# EAGLE schematic Hive 1.1 (EAGLE 9.6.2)
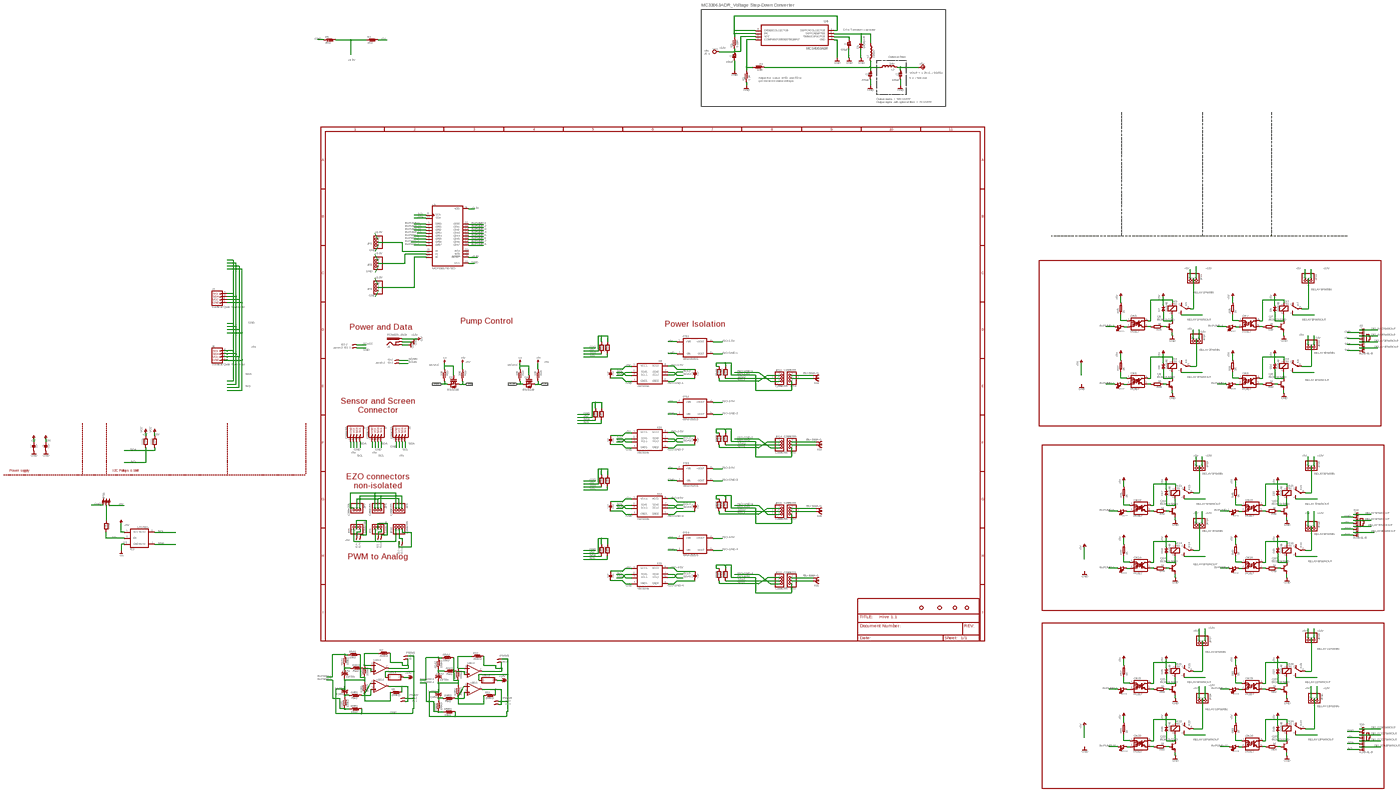
[diagram p0: schematic, sheet 1, overview]
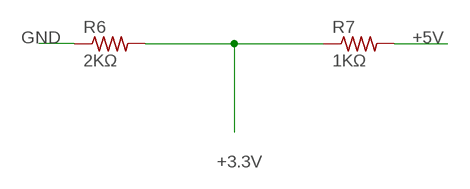
[diagram p1: schematic, sheet 1, part 1 of 5]
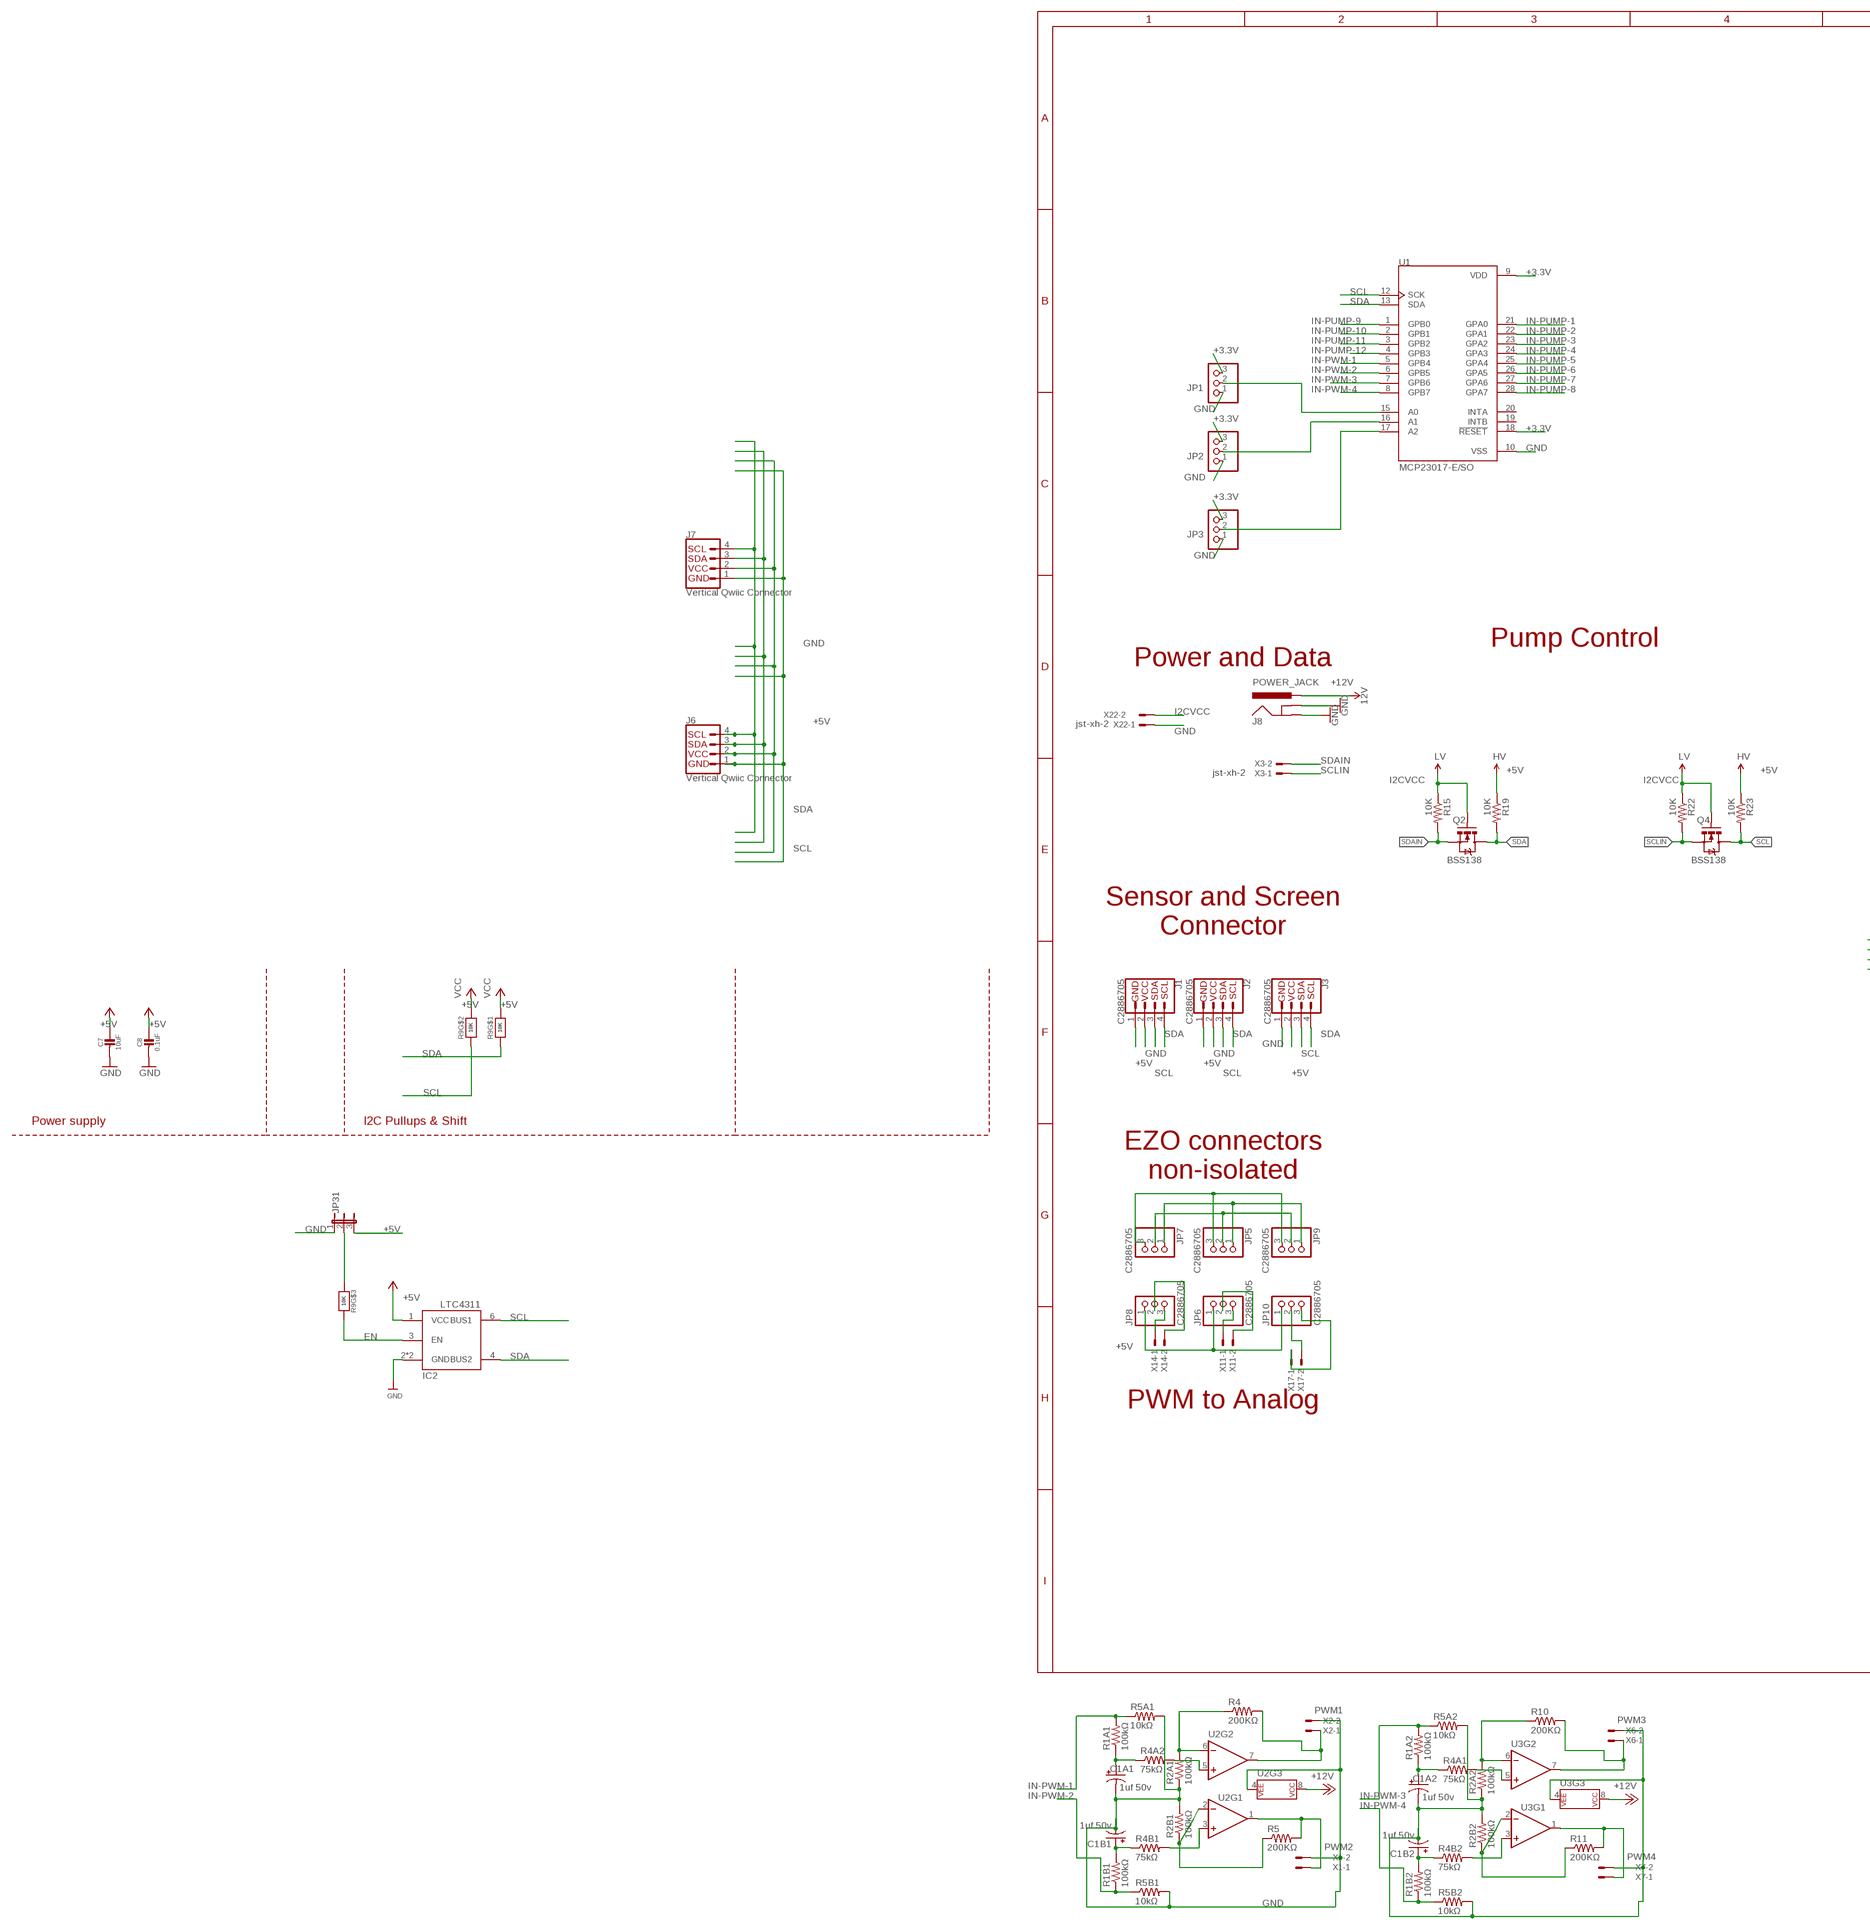
[diagram p2: schematic, sheet 1, part 2 of 5]
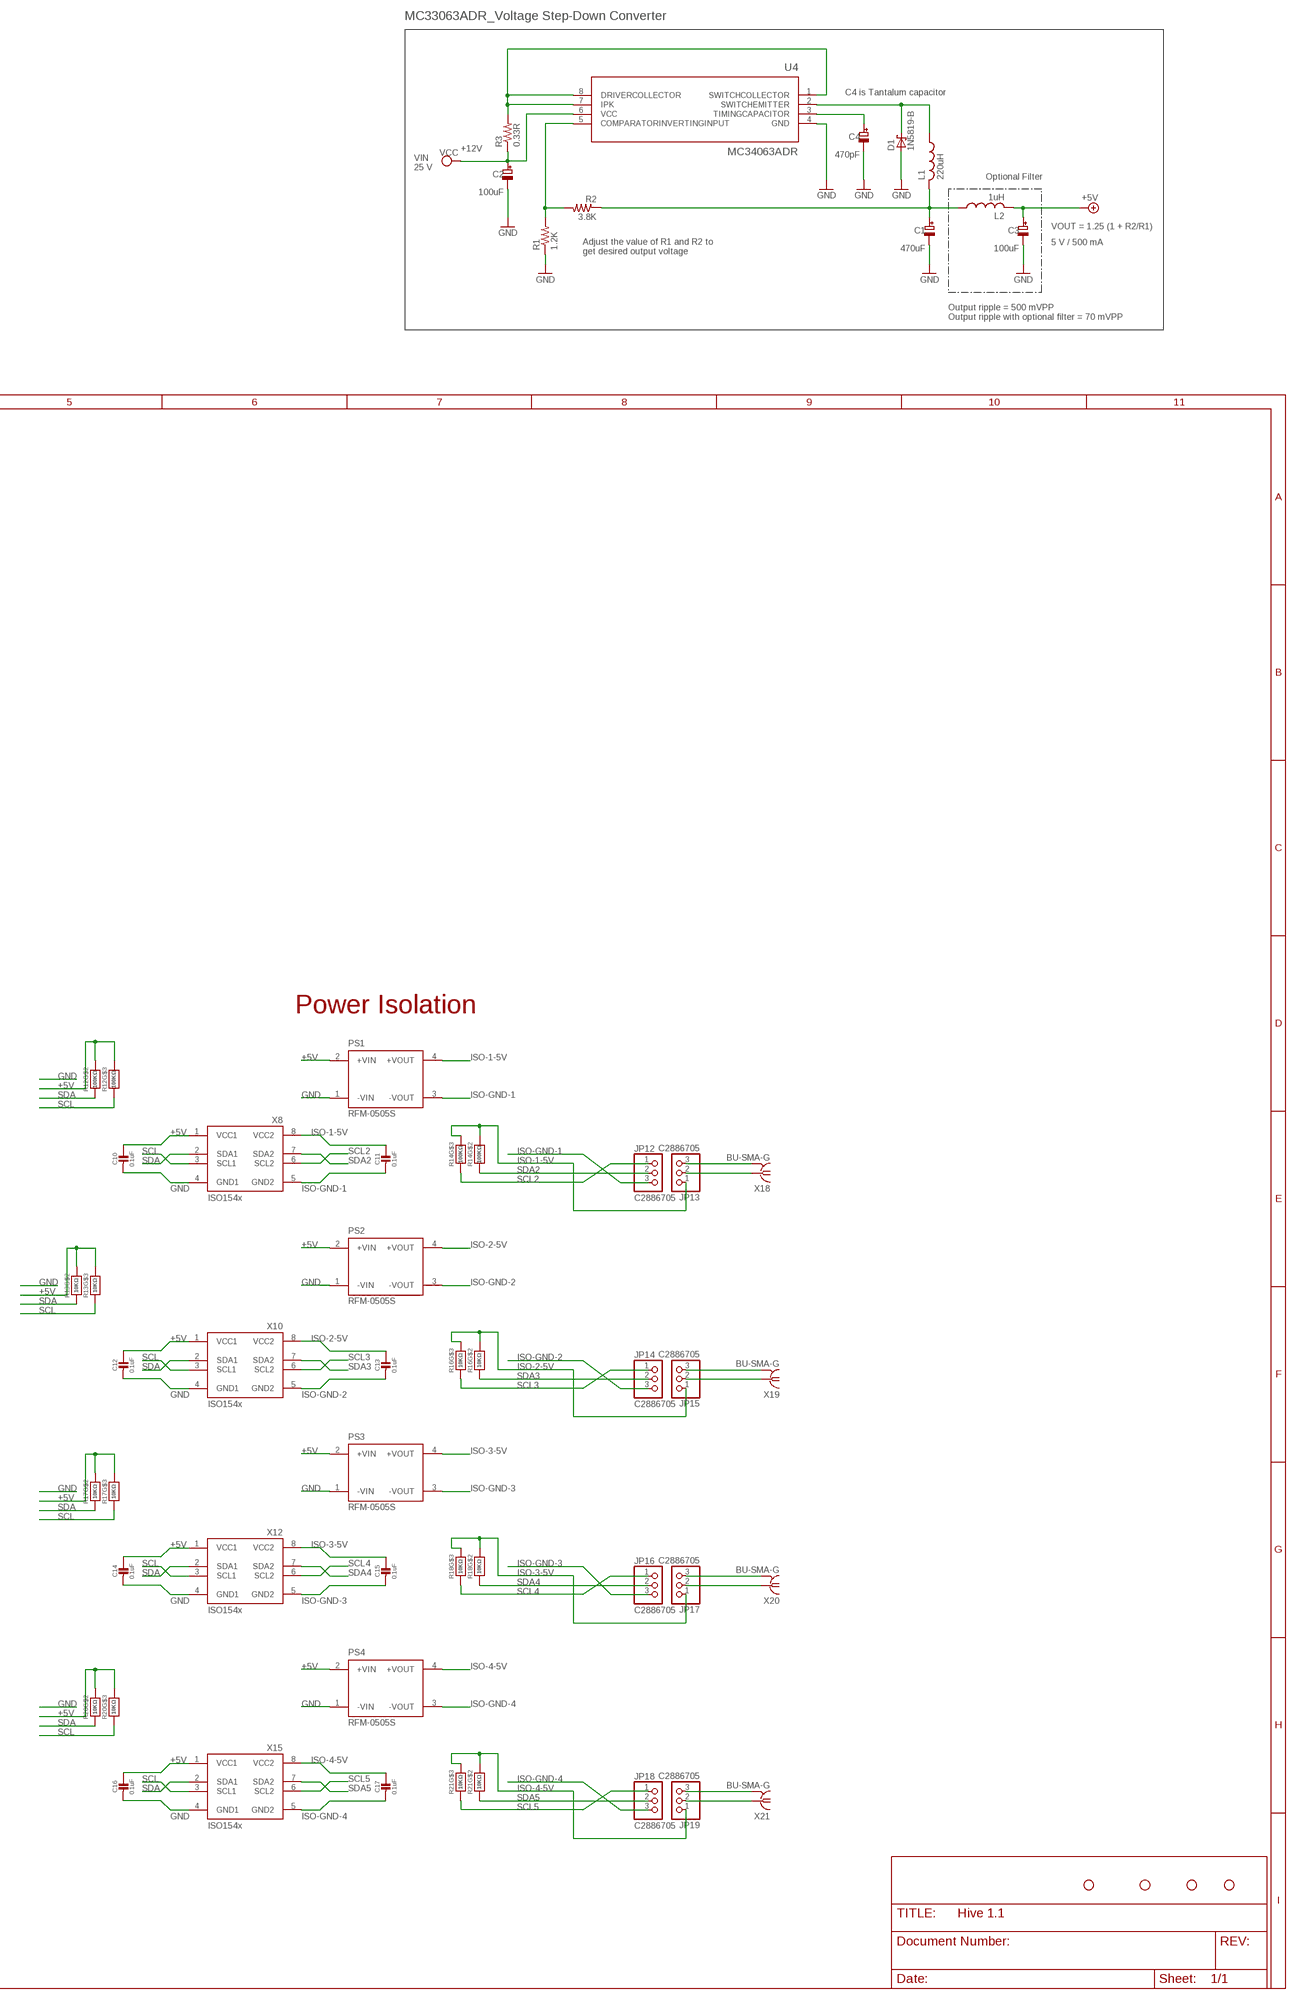
[diagram p3: schematic, sheet 1, part 3 of 5]
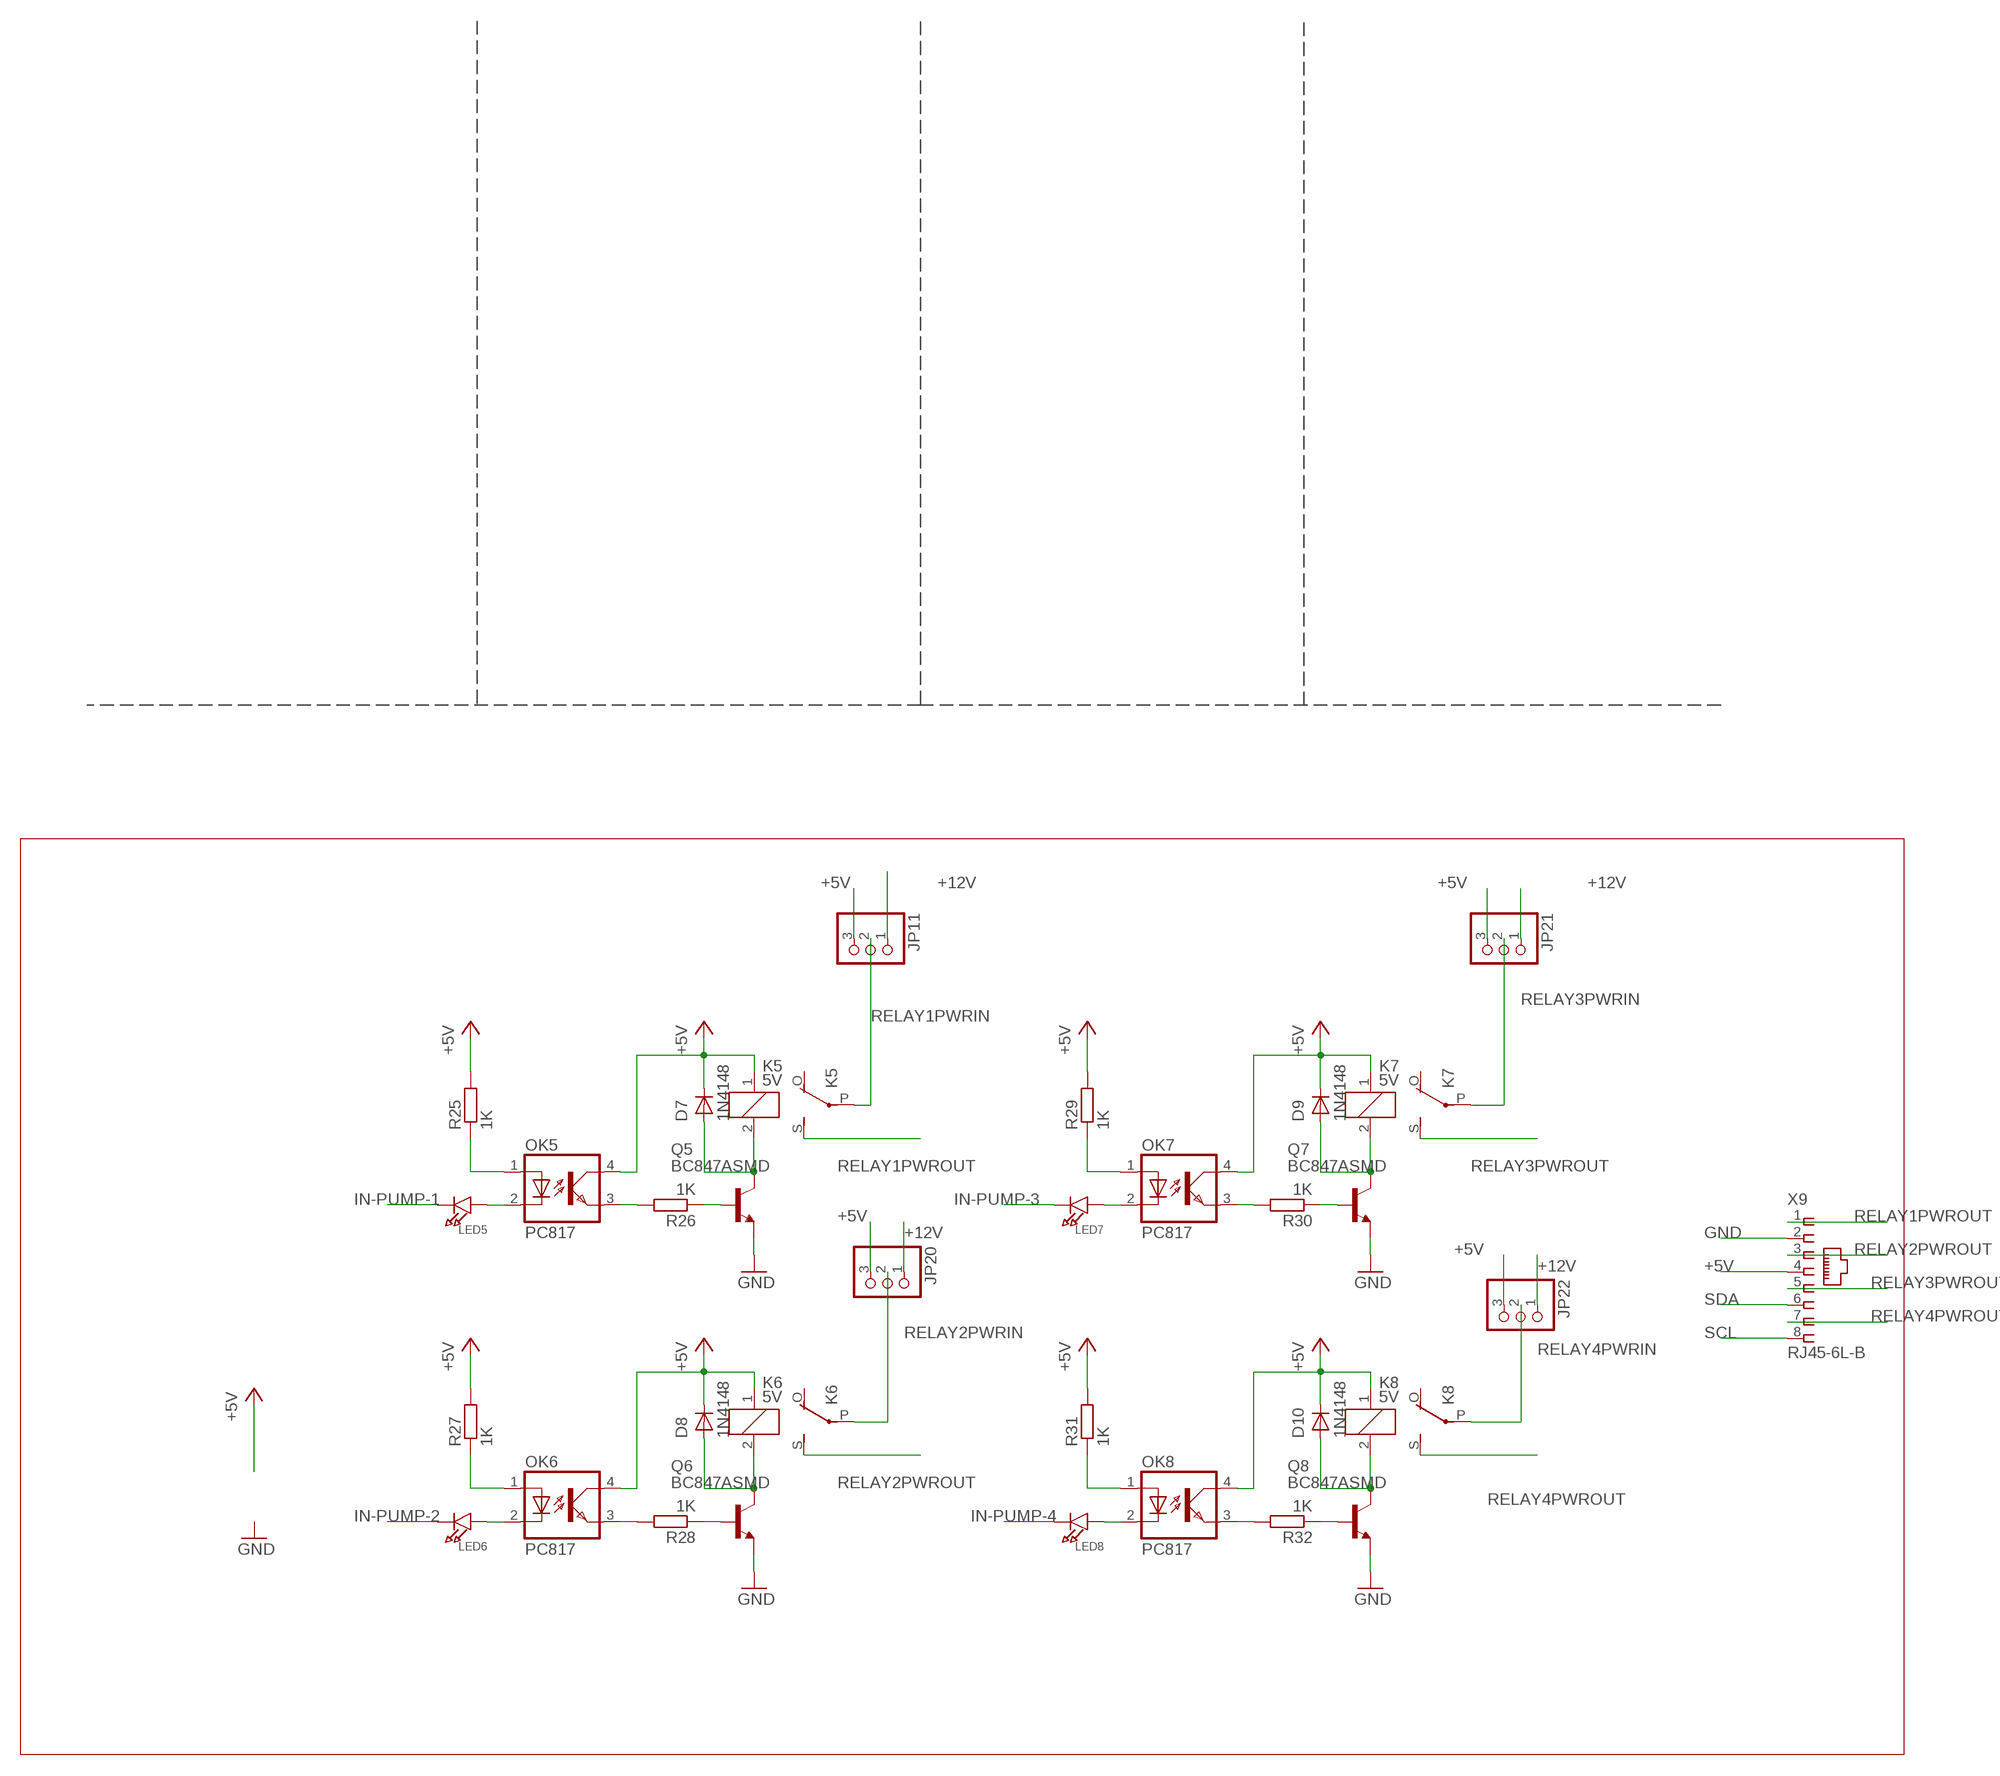
[diagram p4: schematic, sheet 1, part 4 of 5]
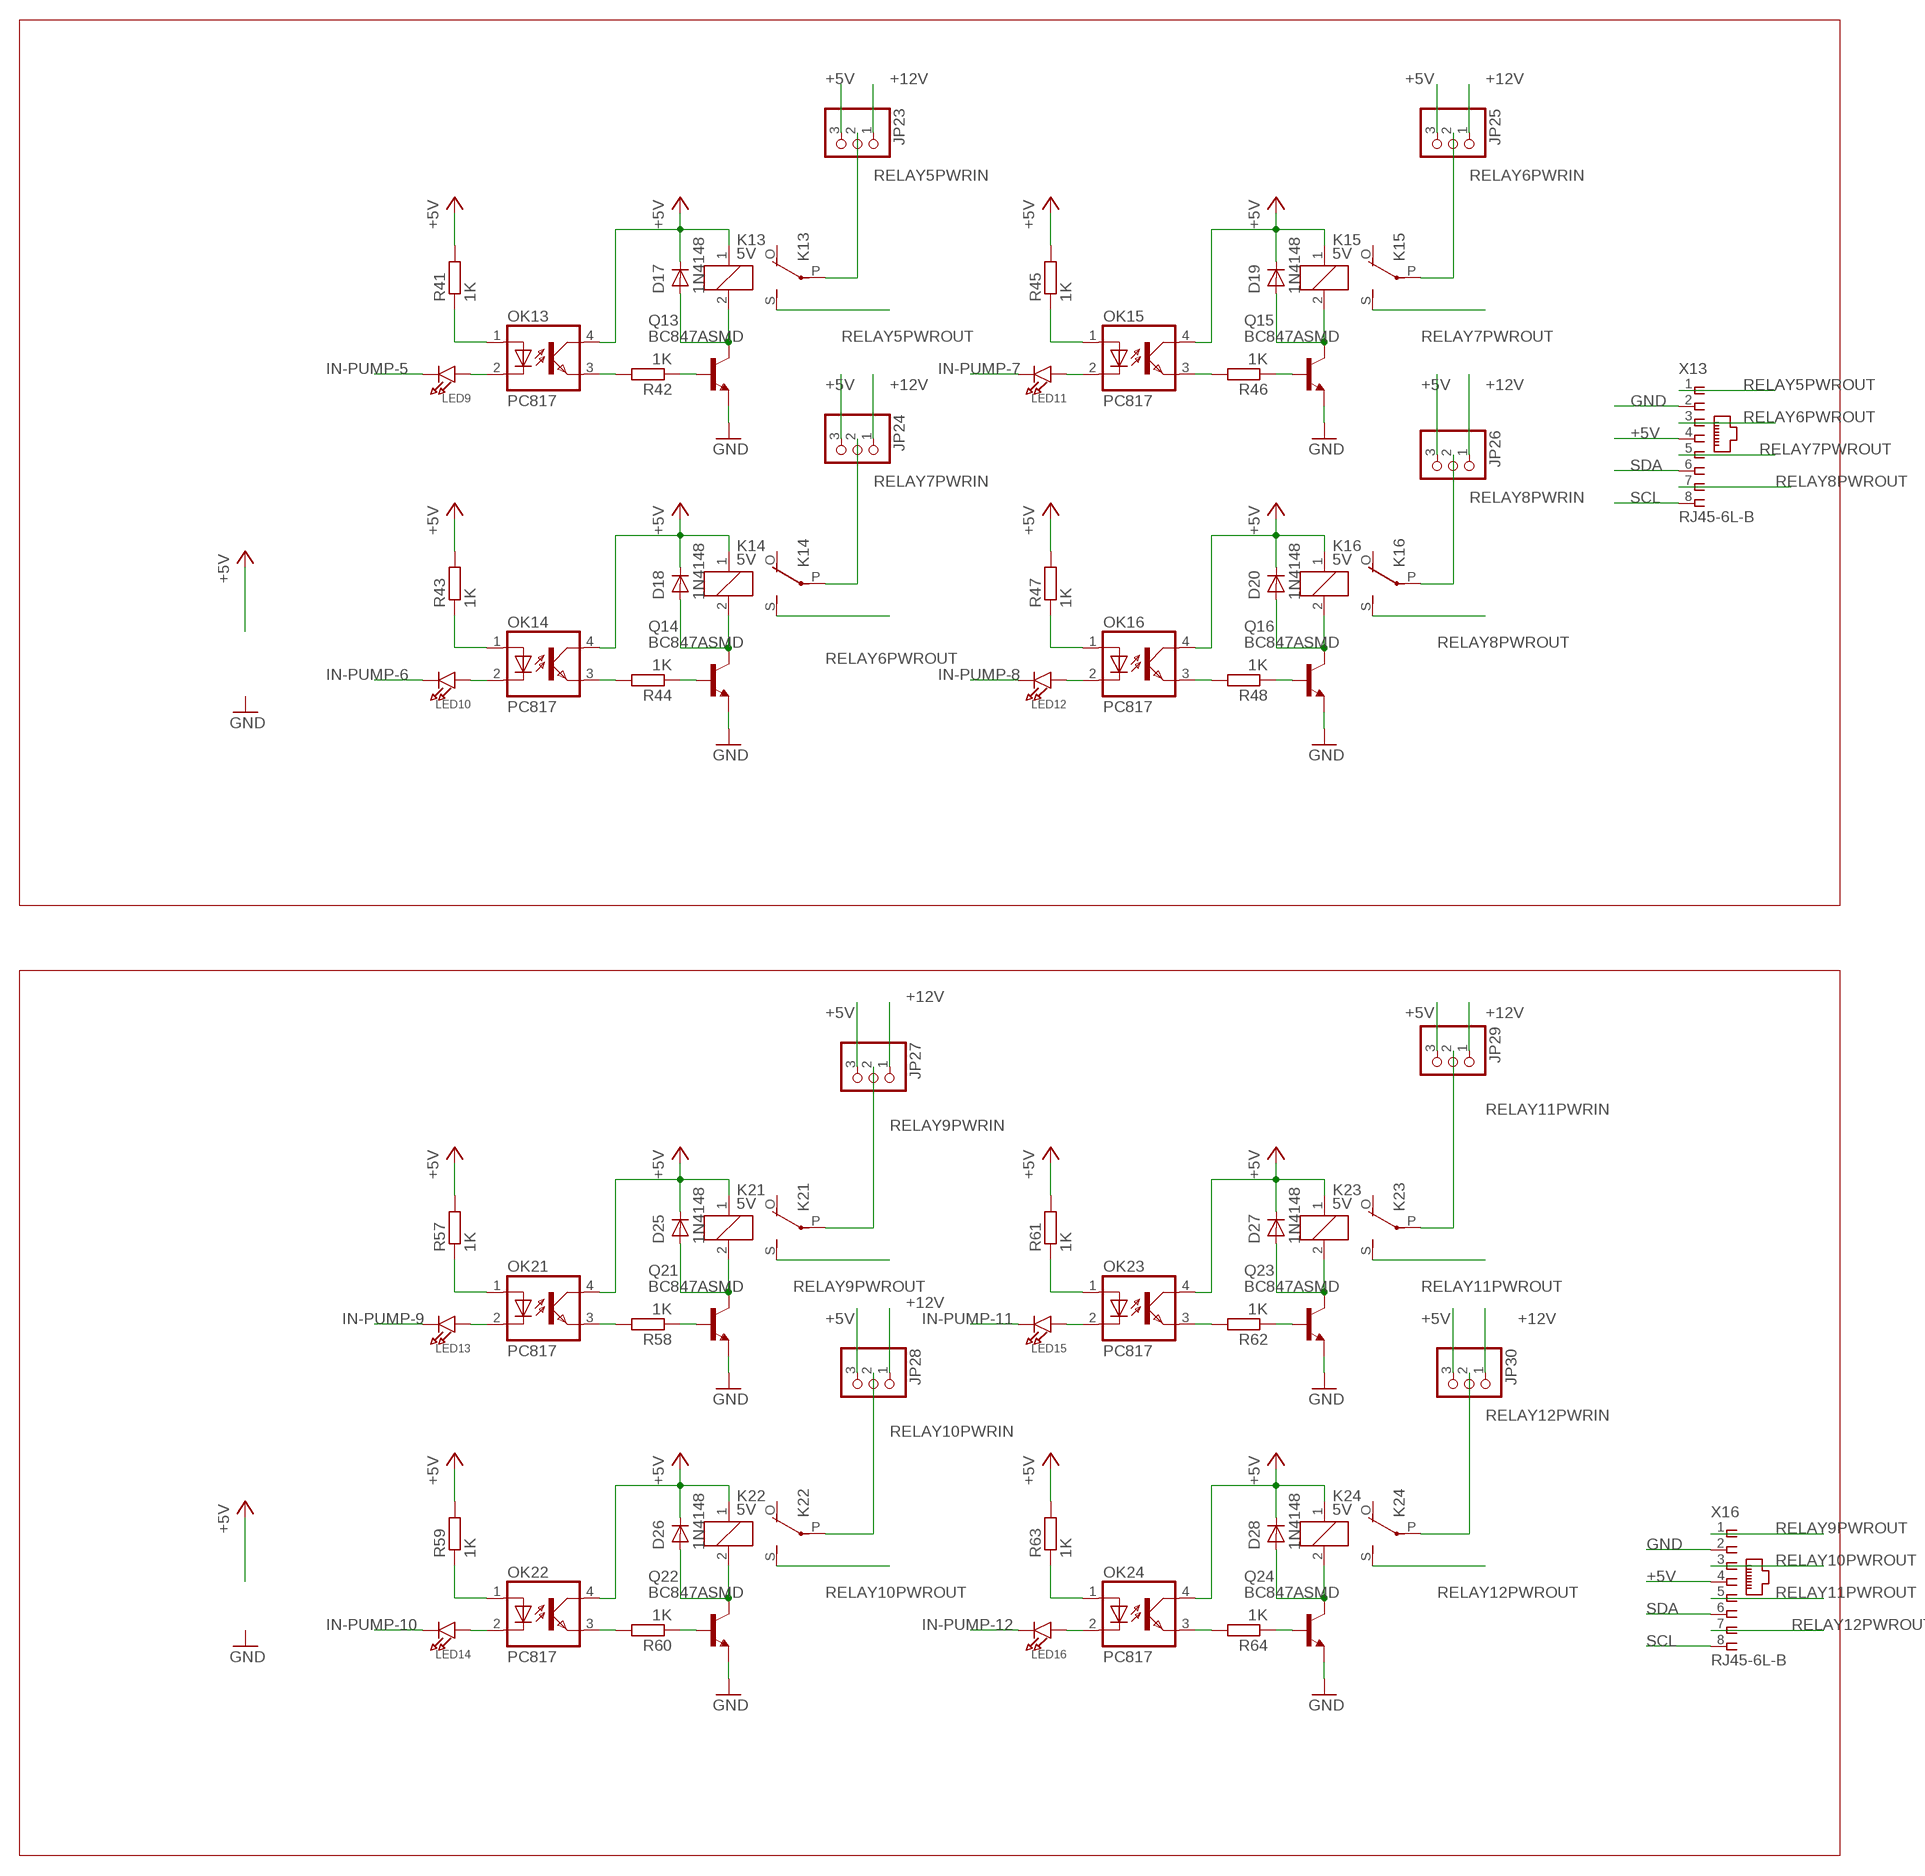
[diagram p5: schematic, sheet 1, part 5 of 5]

## Parts
C1  470uF  CAP_ELECTROLYTICPANASONIC_C  [PANASONIC_C]
C1A1  1uf 50v  CPOL-USUD-4X5,8  [UD-4X5,8_NICHICON]
C1A2  1uf 50v  CPOL-USUD-4X5,8  [UD-4X5,8_NICHICON]
C1B1  1uf 50v  CPOL-USUD-4X5,8  [UD-4X5,8_NICHICON]
C1B2  1uf 50v  CPOL-USUD-4X5,8  [UD-4X5,8_NICHICON]
C2  100uF  CAP_ELECTROLYTICPANASONIC_C  [PANASONIC_C]
C3  100uF  CAP_ELECTROLYTICPANASONIC_C  [PANASONIC_C]
C4  470pF  CAP_ELECTROLYTICPANASONIC_C  [PANASONIC_C]
C7  10uF  CAP_CERAMIC0805-NOOUTLINE  [0805-NO]
C8  0.1uF  CAP_CERAMIC0603_NO  [0603-NO]
C10  0.1uF  CAP_CERAMIC0603_NO  [0603-NO]
C11  0.1uF  CAP_CERAMIC0603_NO  [0603-NO]
C12  0.1uF  CAP_CERAMIC0603_NO  [0603-NO]
C13  0.1uF  CAP_CERAMIC0603_NO  [0603-NO]
C14  0.1uF  CAP_CERAMIC0603_NO  [0603-NO]
C15  0.1uF  CAP_CERAMIC0603_NO  [0603-NO]
C16  0.1uF  CAP_CERAMIC0603_NO  [0603-NO]
C17  0.1uF  CAP_CERAMIC0603_NO  [0603-NO]
D1  1N5819-B  [DO41-7.6]
D7  1N4148  GF1  [SMA-DO214AC]
D8  1N4148  GF1  [SMA-DO214AC]
D9  1N4148  GF1  [SMA-DO214AC]
D10  1N4148  GF1  [SMA-DO214AC]
D17  1N4148  GF1  [SMA-DO214AC]
D18  1N4148  GF1  [SMA-DO214AC]
D19  1N4148  GF1  [SMA-DO214AC]
D20  1N4148  GF1  [SMA-DO214AC]
D25  1N4148  GF1  [SMA-DO214AC]
D26  1N4148  GF1  [SMA-DO214AC]
D27  1N4148  GF1  [SMA-DO214AC]
D28  1N4148  GF1  [SMA-DO214AC]
H1  STAND-OFF  [STAND-OFF]
H2  STAND-OFF  [STAND-OFF]
H3  STAND-OFF  [STAND-OFF]
H4  STAND-OFF  [STAND-OFF]
IC2  LTC4311_SC70  [SC70-6L]
J1  C2886705  I2C_STANDARD  [1X04]
J2  C2886705  I2C_STANDARD  [1X04]
J3  C2886705  I2C_STANDARD  [1X04]
J6  Vertical Qwiic Connector  QWIIC_CONNECTOR  [JST04_1MM_VERT]
J7  Vertical Qwiic Connector  QWIIC_CONNECTOR  [JST04_1MM_VERT]
J8  POWER_JACK  [POWER_JACK_PTH]
JP1  HEADER-1X3ROUND  [1X03_ROUND]
JP2  HEADER-1X3ROUND  [1X03_ROUND]
JP3  HEADER-1X3ROUND  [1X03_ROUND]
JP5  C2886705  PINHD-1X3CB  [1X03-CLEANBIG]
JP6  C2886705  PINHD-1X3CB  [1X03-CLEANBIG]
JP7  C2886705  PINHD-1X3CB  [1X03-CLEANBIG]
JP8  C2886705  PINHD-1X3CB  [1X03-CLEANBIG]
JP9  C2886705  PINHD-1X3CB  [1X03-CLEANBIG]
JP10  C2886705  PINHD-1X3CB  [1X03-CLEANBIG]
JP11  PINHD-1X3  [1X03]
JP12  C2886705  PINHD-1X3CB  [1X03-CLEANBIG]
JP13  C2886705  PINHD-1X3CB  [1X03-CLEANBIG]
JP14  C2886705  PINHD-1X3CB  [1X03-CLEANBIG]
JP15  C2886705  PINHD-1X3CB  [1X03-CLEANBIG]
JP16  C2886705  PINHD-1X3CB  [1X03-CLEANBIG]
JP17  C2886705  PINHD-1X3CB  [1X03-CLEANBIG]
JP18  C2886705  PINHD-1X3CB  [1X03-CLEANBIG]
JP19  C2886705  PINHD-1X3CB  [1X03-CLEANBIG]
JP20  PINHD-1X3  [1X03]
JP21  PINHD-1X3  [1X03]
JP22  PINHD-1X3  [1X03]
JP23  PINHD-1X3  [1X03]
JP24  PINHD-1X3  [1X03]
JP25  PINHD-1X3  [1X03]
JP26  PINHD-1X3  [1X03]
JP27  PINHD-1X3  [1X03]
JP28  PINHD-1X3  [1X03]
JP29  PINHD-1X3  [1X03]
JP30  PINHD-1X3  [1X03]
JP31  JUMPER3  [JUMPER3]
K5  5V  ZF112  [ZF112]
K6  5V  ZF112  [ZF112]
K7  5V  ZF112  [ZF112]
K8  5V  ZF112  [ZF112]
K13  5V  ZF112  [ZF112]
K14  5V  ZF112  [ZF112]
K15  5V  ZF112  [ZF112]
K16  5V  ZF112  [ZF112]
K21  5V  ZF112  [ZF112]
K22  5V  ZF112  [ZF112]
K23  5V  ZF112  [ZF112]
K24  5V  ZF112  [ZF112]
L1  220uH  L-USL3216C  [L3216C]
L2  1uH  L-USL3216C  [L3216C]
LED5  LED0603  [CHIPLED_0603]
LED6  LED0603  [CHIPLED_0603]
LED7  LED0603  [CHIPLED_0603]
LED8  LED0603  [CHIPLED_0603]
LED9  LED0603  [CHIPLED_0603]
LED10  LED0603  [CHIPLED_0603]
LED11  LED0603  [CHIPLED_0603]
LED12  LED0603  [CHIPLED_0603]
LED13  LED0603  [CHIPLED_0603]
LED14  LED0603  [CHIPLED_0603]
LED15  LED0603  [CHIPLED_0603]
LED16  LED0603  [CHIPLED_0603]
OK5  PC817  [DIL04]
OK6  PC817  [DIL04]
OK7  PC817  [DIL04]
OK8  PC817  [DIL04]
OK13  PC817  [DIL04]
OK14  PC817  [DIL04]
OK15  PC817  [DIL04]
OK16  PC817  [DIL04]
OK21  PC817  [DIL04]
OK22  PC817  [DIL04]
OK23  PC817  [DIL04]
OK24  PC817  [DIL04]
PS1  RFM-0505S  [CONV_RFM-0505S]
PS2  RFM-0505S  [CONV_RFM-0505S]
PS3  RFM-0505S  [CONV_RFM-0505S]
PS4  RFM-0505S  [CONV_RFM-0505S]
Q2  BSS138  MOSFET-NCHANNELSMD  [SOT23-3]
Q4  BSS138  MOSFET-NCHANNELSMD  [SOT23-3]
Q5  BC847ASMD  [SOT23]
Q6  BC847ASMD  [SOT23]
Q7  BC847ASMD  [SOT23]
Q8  BC847ASMD  [SOT23]
Q13  BC847ASMD  [SOT23]
Q14  BC847ASMD  [SOT23]
Q15  BC847ASMD  [SOT23]
Q16  BC847ASMD  [SOT23]
Q21  BC847ASMD  [SOT23]
Q22  BC847ASMD  [SOT23]
Q23  BC847ASMD  [SOT23]
Q24  BC847ASMD  [SOT23]
R1  1.2K  R-US_M0805  [M0805]
R1A1  100kΩ  R-US_M1206  [M1206]
R1A2  100kΩ  R-US_M1206  [M1206]
R1B1  100kΩ  R-US_M1206  [M1206]
R1B2  100kΩ  R-US_M1206  [M1206]
R2  3.8K  R-US_M0805  [M0805]
R2A1  100kΩ  R-US_M1206  [M1206]
R2A2  100kΩ  R-US_M1206  [M1206]
R2B1  100kΩ  R-US_M1206  [M1206]
R2B2  100kΩ  R-US_M1206  [M1206]
R3  0.33R  R-US_M0805  [M0805]
R4  200KΩ  R-US_R0402  [R0402]
R4A1  75kΩ  R-US_M1206  [M1206]
R4A2  75kΩ  R-US_M1206  [M1206]
R4B1  75kΩ  R-US_M1206  [M1206]
R4B2  75kΩ  R-US_M1206  [M1206]
R5  200KΩ  R-US_R0402  [R0402]
R5A1  10kΩ  R-US_M1206  [M1206]
R5A2  10kΩ  R-US_M1206  [M1206]
R5B1  10kΩ  R-US_M1206  [M1206]
R5B2  10kΩ  R-US_M1206  [M1206]
R6  2KΩ  R-US_R1206  [R1206]
R7  1KΩ  R-US_R1206  [R1206]
R9  10K  RESISTOR_4PACK  [RESPACK_4X0603]
R10  200KΩ  R-US_R0402  [R0402]
R11  200KΩ  R-US_R0402  [R0402]
R12  100KΩ  RESISTOR_4PACK  [RESPACK_4X0603]
R13  10KΩ  RESISTOR_4PACK  [RESPACK_4X0603]
R14  100KΩ  RESISTOR_4PACK  [RESPACK_4X0603]
R15  10K  RESISTOR0603-RES  [0603-RES]
R16  10KΩ  RESISTOR_4PACK  [RESPACK_4X0603]
R17  10KΩ  RESISTOR_4PACK  [RESPACK_4X0603]
R18  10KΩ  RESISTOR_4PACK  [RESPACK_4X0603]
R19  10K  RESISTOR0603-RES  [0603-RES]
R20  10KΩ  RESISTOR_4PACK  [RESPACK_4X0603]
R21  10KΩ  RESISTOR_4PACK  [RESPACK_4X0603]
R22  10K  RESISTOR0603-RES  [0603-RES]
R23  10K  RESISTOR0603-RES  [0603-RES]
R25  1K  R-EU_R1206  [R1206]
R26  1K  R-EU_R1206  [R1206]
R27  1K  R-EU_R1206  [R1206]
R28  1K  R-EU_R1206  [R1206]
R29  1K  R-EU_R1206  [R1206]
R30  1K  R-EU_R1206  [R1206]
R31  1K  R-EU_R1206  [R1206]
R32  1K  R-EU_R1206  [R1206]
R41  1K  R-EU_R1206  [R1206]
R42  1K  R-EU_R1206  [R1206]
R43  1K  R-EU_R1206  [R1206]
R44  1K  R-EU_R1206  [R1206]
R45  1K  R-EU_R1206  [R1206]
R46  1K  R-EU_R1206  [R1206]
R47  1K  R-EU_R1206  [R1206]
R48  1K  R-EU_R1206  [R1206]
R57  1K  R-EU_R1206  [R1206]
R58  1K  R-EU_R1206  [R1206]
R59  1K  R-EU_R1206  [R1206]
R60  1K  R-EU_R1206  [R1206]
R61  1K  R-EU_R1206  [R1206]
R62  1K  R-EU_R1206  [R1206]
R63  1K  R-EU_R1206  [R1206]
R64  1K  R-EU_R1206  [R1206]
U1  MCP23017-E/SO  [SOIC127P1030X265-28N]
U2  LM358  LM358SO08  [SO08]
U3  LM358  LM358SO08  [SO08]
U4  MC34063ADR  [D8]
X1  PWM2  JST-XH-02-PIN-LONG-PAD  [JST-XH-02-PACKAGE-LONG-PAD]
X2  PWM1  JST-XH-02-PIN-LONG-PAD  [JST-XH-02-PACKAGE-LONG-PAD]
X3  jst-xh-2  JST-XH-02-PIN-LONG-PAD  [JST-XH-02-PACKAGE-LONG-PAD]
X6  PWM3  JST-XH-02-PIN-LONG-PAD  [JST-XH-02-PACKAGE-LONG-PAD]
X7  PWM4  JST-XH-02-PIN-LONG-PAD  [JST-XH-02-PACKAGE-LONG-PAD]
X8  ISO154X  [SOIC8_150MIL]
X9  RJ45-6L-B  [RJ45-NO-SHIELD]
X10  ISO154X  [SOIC8_150MIL]
X11  jst-xh-2  JST-XH-02-PIN-LONG-PAD  [JST-XH-02-PACKAGE-LONG-PAD]
X12  ISO154X  [SOIC8_150MIL]
X13  RJ45-6L-B  [RJ45-NO-SHIELD]
X14  jst-xh-2  JST-XH-02-PIN-LONG-PAD  [JST-XH-02-PACKAGE-LONG-PAD]
X15  ISO154X  [SOIC8_150MIL]
X16  RJ45-6L-B  [RJ45-NO-SHIELD]
X17  jst-xh-2  JST-XH-02-PIN-LONG-PAD  [JST-XH-02-PACKAGE-LONG-PAD]
X18  BU-SMA-G  [BU-SMA-G]
X19  BU-SMA-G  [BU-SMA-G]
X20  BU-SMA-G  [BU-SMA-G]
X21  BU-SMA-G  [BU-SMA-G]
X22  jst-xh-2  JST-XH-02-PIN-LONG-PAD  [JST-XH-02-PACKAGE-LONG-PAD]

## Nets
+3.3V [3.3v]: JP1.3 JP2.3 JP3.3 R6.2 R7.1 U1.9(VDD) U1.18(!RESET)
+5V [5v]: C3.+ C7.1 C8.1 C10.1 C12.1 C14.1 C16.1 D7.K(C) D8.K(C) D9.K(C) D10.K(C) D17.K(C) D18.K(C) D19.K(C) D20.K(C) D25.K(C) D26.K(C) D27.K(C) D28.K(C) IC2.1(VCC) J1.1 J2.1 J3.2 J6.3 J7.3 JP6.1 JP8.1 JP10.1 JP11.3 JP20.3 JP21.3 JP22.3 JP23.3 JP24.3 JP25.3 JP26.3 JP27.3 JP28.3 JP29.3 JP30.3 JP31.3 K5.1 K6.1 K7.1 K8.1 K13.1 K14.1 K15.1 K16.1 K21.1 K22.1 K23.1 K24.1 L2.2 OK5.4(COL) OK6.4(COL) OK7.4(COL) OK8.4(COL) OK13.4(COL) OK14.4(COL) OK15.4(COL) OK16.4(COL) OK21.4(COL) OK22.4(COL) OK23.4(COL) OK24.4(COL) PS1.2(+VIN) PS2.2(+VIN) PS3.2(+VIN) PS4.2(+VIN) R7.2 R9.7 R9.8 R12.6 R12.7 R13.6 R13.7 R17.6 R17.7 R19.1 R20.6 R20.7 R23.1 R25.2 R27.2 R29.2 R31.2 R41.2 R43.2 R45.2 R47.2 R57.2 R59.2 R61.2 R63.2 X8.1(VCC1) X9.4 X10.1(VCC1) X12.1(VCC1) X13.4 X15.1(VCC1) X16.4 ; supply symbol labelled HV, VCC
+12V [12v]: C2.+ J8.PWR JP11.1 JP20.1 JP21.1 JP22.1 JP23.1 JP24.1 JP25.1 JP26.1 JP27.1 JP28.1 JP29.1 JP30.1 R3.1 U2.8(P$V+) U3.8(P$V+) U4.6(VCC) ; supply symbol labelled 12V, VCC
EN: IC2.3(EN) R9.6
GND: C1.- C1A1.- C1A2.- C1B1.- C1B2.- C2.- C3.- C4.- C7.2 C8.2 C10.2 C12.2 C14.2 C16.2 D1.A IC2.2(GND) IC2.5(GND) J1.2 J2.2 J3.1 J6.4 J7.4 J8.GND J8.GNDBREAK JP1.1 JP2.1 JP3.1 JP5.3 JP7.3 JP9.3 JP31.1 PS1.1(-VIN) PS2.1(-VIN) PS3.1(-VIN) PS4.1(-VIN) Q5.2(E) Q6.2(E) Q7.2(E) Q8.2(E) Q13.2(E) Q14.2(E) Q15.2(E) Q16.2(E) Q21.2(E) Q22.2(E) Q23.2(E) Q24.2(E) R1.1 R2A1.1 R2A2.1 R2B1.2 R2B2.2 R5A1.2 R5A2.2 R5B1.2 R5B2.2 R6.1 U1.10(VSS) U2.4(P$V-) U3.4(P$V-) U4.4(GND) X1.2 X2.2 X6.2 X7.2 X8.4(GND1) X9.2 X10.4(GND1) X12.4(GND1) X13.2 X15.4(GND1) X16.2 X22.1
I2CVCC [5v]: Q2.1(G) Q4.1(G) R15.1 R22.1 X22.2 ; supply symbol labelled LV
IN-PUMP-1: LED5.C U1.21(GPA0)
IN-PUMP-2: LED6.C U1.22(GPA1)
IN-PUMP-3: LED7.C U1.23(GPA2)
IN-PUMP-4: LED8.C U1.24(GPA3)
IN-PUMP-5 [GPIO]: LED9.C U1.25(GPA4)
IN-PUMP-6 [GPIO]: LED10.C U1.26(GPA5)
IN-PUMP-7 [GPIO]: LED11.C U1.27(GPA6)
IN-PUMP-8 [GPIO]: LED12.C U1.28(GPA7)
IN-PUMP-9 [GPIO]: LED13.C U1.1(GPB0)
IN-PUMP-10 [GPIO]: LED14.C U1.2(GPB1)
IN-PUMP-11 [GPIO]: LED15.C U1.3(GPB2)
IN-PUMP-12 [GPIO]: LED16.C U1.4(GPB3)
IN-PWM-1: R1A1.2 R5A1.1 U1.5(GPB4)
IN-PWM-2: R1B1.1 R5B1.1 U1.6(GPB5)
IN-PWM-3: R1A2.2 R5A2.1 U1.7(GPB6)
IN-PWM-4: R1B2.1 R5B2.1 U1.8(GPB7)
ISO-1-5V: C11.1 JP13.1 PS1.4(+VOUT) R14.6 R14.7 X8.8(VCC2)
ISO-2-5V: C13.1 JP15.1 PS2.4(+VOUT) R16.6 R16.7 X10.8(VCC2)
ISO-3-5V: C15.1 JP17.1 PS3.4(+VOUT) R18.6 R18.7 X12.8(VCC2)
ISO-4-5V: C17.1 JP19.1 PS4.4(+VOUT) R21.6 R21.7 X15.8(VCC2)
ISO-GND-1: C11.2 JP12.3 PS1.3(-VOUT) X8.5(GND2)
ISO-GND-2: C13.2 JP14.3 PS2.3(-VOUT) X10.5(GND2)
ISO-GND-3: C15.2 JP16.3 PS3.3(-VOUT) X12.5(GND2)
ISO-GND-4: C17.2 JP18.3 PS4.3(-VOUT) X15.5(GND2)
ISO-PRB-1+: JP13.2 X18.1
ISO-PRB-1GND: JP13.3 X18.2 X18.3 X18.4 X18.5
ISO-PRB-2+: JP15.2 X19.1
ISO-PRB-2GND: JP15.3 X19.2 X19.3 X19.4 X19.5
ISO-PRB-3+: JP17.2 X20.1
ISO-PRB-3GND: JP17.3 X20.2 X20.3 X20.4 X20.5
ISO-PRB-4+: JP19.2 X21.1
ISO-PRB-4GND: JP19.3 X21.2 X21.3 X21.4 X21.5
N$1: C1A1.+ R1A1.1 R4A2.1
N$2: D1.C JP31.2 L1.1 R9.3 U4.2(SWITCHEMITTER)
N$3: C1.+ L1.2 L2.1 R2.1
N$4: C4.+ U4.3(TIMINGCAPACITOR)
N$5: C1B1.+ R1B1.2 R4B1.1
N$6: R2A1.2 R4.1 U2.6(-IN)
N$7: R1.2 R2.2 U4.5(COMPARATORINVERTINGINPUT)
N$8: R2B1.1 R5.1 U2.2(-IN)
N$9: R3.2 U4.1(SWITCHCOLLECTOR) U4.7(IPK) U4.8(DRIVERCOLLECTOR)
N$10: R4A2.2 U2.5(+IN)
N$11: R4B1.2 U2.3(+IN)
N$53: C1A2.+ R1A2.1 R4A1.1
N$54: C1B2.+ R1B2.2 R4B2.1
N$55: R2A2.2 R10.1 U3.6(-IN)
N$56: R2B2.1 R11.1 U3.2(-IN)
N$57: R4A1.2 U3.5(+IN)
N$58: R4B2.2 U3.3(+IN)
N$74: JP1.2 U1.15(A0)
N$75: JP2.2 U1.16(A1)
N$76: JP3.2 U1.17(A2)
N$86: LED5.A OK5.2(C)
N$90: OK5.1(A) R25.1
N$91: OK5.3(EMIT) R26.2
N$92: D7.A K5.2 Q5.3(C)
N$93: Q5.1(B) R26.1
N$94: LED6.A OK6.2(C)
N$98: OK6.1(A) R27.1
N$99: OK6.3(EMIT) R28.2
N$100: D8.A K6.2 Q6.3(C)
N$101: Q6.1(B) R28.1
N$102: LED7.A OK7.2(C)
N$106: OK7.1(A) R29.1
N$107: OK7.3(EMIT) R30.2
N$108: D9.A K7.2 Q7.3(C)
N$109: Q7.1(B) R30.1
N$110: LED8.A OK8.2(C)
N$114: OK8.1(A) R31.1
N$115: OK8.3(EMIT) R32.2
N$116: D10.A K8.2 Q8.3(C)
N$117: Q8.1(B) R32.1
N$150: LED9.A OK13.2(C)
N$154: OK13.1(A) R41.1
N$155: OK13.3(EMIT) R42.2
N$156: D17.A K13.2 Q13.3(C)
N$157: Q13.1(B) R42.1
N$158: LED10.A OK14.2(C)
N$162: OK14.1(A) R43.1
N$163: OK14.3(EMIT) R44.2
N$164: D18.A K14.2 Q14.3(C)
N$165: Q14.1(B) R44.1
N$166: LED11.A OK15.2(C)
N$170: OK15.1(A) R45.1
N$171: OK15.3(EMIT) R46.2
N$172: D19.A K15.2 Q15.3(C)
N$173: Q15.1(B) R46.1
N$174: LED12.A OK16.2(C)
N$178: OK16.1(A) R47.1
N$179: OK16.3(EMIT) R48.2
N$180: D20.A K16.2 Q16.3(C)
N$181: Q16.1(B) R48.1
N$214: LED13.A OK21.2(C)
N$218: OK21.1(A) R57.1
N$219: OK21.3(EMIT) R58.2
N$220: D25.A K21.2 Q21.3(C)
N$221: Q21.1(B) R58.1
N$222: LED14.A OK22.2(C)
N$226: OK22.1(A) R59.1
N$227: OK22.3(EMIT) R60.2
N$228: D26.A K22.2 Q22.3(C)
N$229: Q22.1(B) R60.1
N$230: LED15.A OK23.2(C)
N$234: OK23.1(A) R61.1
N$235: OK23.3(EMIT) R62.2
N$236: D27.A K23.2 Q23.3(C)
N$237: Q23.1(B) R62.1
N$238: LED16.A OK24.2(C)
N$242: OK24.1(A) R63.1
N$243: OK24.3(EMIT) R64.2
N$244: D28.A K24.2 Q24.3(C)
N$245: Q24.1(B) R64.1
NISO-PRB-1+: JP6.2 X11.2
NISO-PRB-1GND: JP6.3 X11.1
NISO-PRB-2+: JP8.2 X14.2
NISO-PRB-2GND: JP8.3 X14.1
NISO-PRB-3+: JP10.2 X17.2
NISO-PRB-3GND: JP10.3 X17.1
PWM-OUT-1: R4.2 U2.7(OUT) X2.1
PWM-OUT-2: R5.2 U2.1(OUT) X1.1
PWM-OUT-3: R10.2 U3.7(OUT) X6.1
PWM-OUT-4: R11.2 U3.1(OUT) X7.1
RELAY1PWRIN: JP11.2 K5.P(2:P)
RELAY1PWROUT: K5.S(2:S) X9.1
RELAY2PWRIN: JP20.2 K6.P(2:P)
RELAY2PWROUT: K6.S(2:S) X9.3
RELAY3PWRIN: JP21.2 K7.P(2:P)
RELAY3PWROUT: K7.S(2:S) X9.5
RELAY4PWRIN: JP22.2 K8.P(2:P)
RELAY4PWROUT: K8.S(2:S) X9.7
RELAY5PWRIN: JP23.2 K13.P(2:P)
RELAY5PWROUT: K13.S(2:S) X13.1
RELAY6PWRIN: JP25.2 K15.P(2:P)
RELAY6PWROUT: K14.S(2:S) X13.3
RELAY7PWRIN: JP24.2 K14.P(2:P)
RELAY7PWROUT: K15.S(2:S) X13.5
RELAY8PWRIN: JP26.2 K16.P(2:P)
RELAY8PWROUT: K16.S(2:S) X13.7
RELAY9PWRIN: JP27.2 K21.P(2:P)
RELAY9PWROUT: K21.S(2:S) X16.1
RELAY10PWRIN: JP28.2 K22.P(2:P)
RELAY10PWROUT: K22.S(2:S) X16.3
RELAY11PWRIN: JP29.2 K23.P(2:P)
RELAY11PWROUT: K23.S(2:S) X16.5
RELAY12PWRIN: JP30.2 K24.P(2:P)
RELAY12PWROUT: K24.S(2:S) X16.7
SCL [i2c]: IC2.6(BUS1) J1.3 J2.3 J3.3 J6.1 J7.1 JP5.1 JP7.1 JP9.1 Q4.3(D) R9.2 R12.3 R13.3 R17.3 R20.3 R23.2 U1.12(SCK) X8.3(SCL1) X9.8 X10.3(SCL1) X12.3(SCL1) X13.8 X15.3(SCL1) X16.8
SCL2: JP12.1 R14.3 X8.6(SCL2)
SCL3: JP14.1 R16.3 X10.6(SCL2)
SCL4: JP16.1 R18.3 X12.6(SCL2)
SCL5: JP18.1 R21.3 X15.6(SCL2)
SCLIN [i2c]: Q4.2(S) R22.2 X3.1
SDA [i2c]: IC2.4(BUS2) J1.4 J2.4 J3.4 J6.2 J7.2 JP5.2 JP7.2 JP9.2 Q2.3(D) R9.1 R12.2 R13.2 R17.2 R19.2 R20.2 U1.13(SDA) X8.2(SDA1) X9.6 X10.2(SDA1) X12.2(SDA1) X13.6 X15.2(SDA1) X16.6
SDA2: JP12.2 R14.2 X8.7(SDA2)
SDA3: JP14.2 R16.2 X10.7(SDA2)
SDA4: JP16.2 R18.2 X12.7(SDA2)
SDA5: JP18.2 R21.2 X15.7(SDA2)
SDAIN [i2c]: Q2.2(S) R15.2 X3.2
Unconnected: K5.O(2:O) K6.O(2:O) K7.O(2:O) K8.O(2:O) K13.O(2:O) K14.O(2:O) K15.O(2:O) K16.O(2:O) K21.O(2:O) K22.O(2:O) K23.O(2:O) K24.O(2:O) R9.4 R9.5 R12.1 R12.4 R12.5 R12.8 R13.1 R13.4 R13.5 R13.8 R14.1 R14.4 R14.5 R14.8 R16.1 R16.4 R16.5 R16.8 R17.1 R17.4 R17.5 R17.8 R18.1 R18.4 R18.5 R18.8 R20.1 R20.4 R20.5 R20.8 R21.1 R21.4 R21.5 R21.8 U1.19(INTB) U1.20(INTA)

## Notes on the sheet
- MC33063ADR_Voltage Step-Down Converter
- C4 is Tantalum capacitor
- VIN
- 25 V
- Optional Filter
- VOUT = 1.25 (1 + R2/R1)
- 5 V / 500 mA
- Adjust the value of R1 and R2 to
  get desired output voltage
- Output ripple = 500 mVPP
  Output ripple with optional filter = 70 mVPP
- Pump Control
- Power Isolation
- Power and Data
- Sensor and Screen
  Connector
- Power supply | I2C Pullups & Shift
- EZO connectors
  non-isolated
- PWM to Analog

## Library data of the parts
C1-C4 = microbuilder:CAP_ELECTROLYTIC: Electrolytic Capacitors SMT PANASONIC_C - Size C Panasonic Electrolytic Aluminum Capacitor 47µF 16V 20% Electrolytic Capacitor [Digikey: PCE3890TR-ND] PANASONIC_D - Size D Panasonic Electrolytic Aluminum Capacitor 100µF 25V 20% Electrolytic Capacitor [Digikey: PCE3898TR-ND] PTH 3.5 mm grid, 8 mm diameter ... 3.5 mm grid, 10 mm diameter ...
C1A1 C1A2 C1B1 C1B2 = rcl:CPOL-US: POLARIZED CAPACITOR, American symbol
C7 C8 C10-C17 = microbuilder:CAP_CERAMIC: Ceramic Capacitors For new designs, use the packages preceded by an '_' character since they are more reliable: The following footprints should be used on most boards: _0402 - Standard footprint for regular board layouts _0603 - Standard footprint for regular board layouts _0805 - Standard footprint for regular board layouts _1206 - Standard footprint for regular board layouts For extremely tight-pitch boards where space is at a premium, the following 'micro-pitch' footprints can be used (smaller pads, no silkscreen outline, etc.): _0402MP - Micro-pitch footprint for very dense/compact boards _0603MP - Micro-pitch footprint for very dense/compact boards _0805MP - Micro-pitch footprint for very dense/compact boards _1206MP - Micro-pitch footprint for very dense/compact boards
D1 = diode:1N581*: 1.0A SCHOTTKY BARRIER RECTIFIER Source: http://www.diodes.com/datasheets/ds23001.pdf
D7-D10 D17-D20 D25-D28 = diode:GF1: DIODE
H1-H4 = SparkFun-Hardware:STAND-OFF: Stand Off Drill holes for mechanically mounting via screws, standoffs, etc. Note: Use the keepout ring to avoid running the screw head into surrounding components. Variant Overviews STAND-OFF - Mechanical footprint for a #4 phillips button head screw. STAND-OFF-TIGHT - Mechanical footprint for a #4 phillips button head screw, Example SparkFun Products Screw - Phillips Head (1/4", 4-40, 10 pack) <https://www.sparkfun.com/products/10453> (PRT-10453) Screw - Phillips Head (1/2", 4-40, 10 pack) <https://www.sparkfun.com/products/10452> (PRT-10452) Screw - Phillips Head (3/4", 4-40, 10 pack) <https://www.sparkfun.com/products/10451> (PRT-10451) Screw - Phillips Head (1", 4-40, 10 pack) <https://www.sparkfun.com/products/10450> (PRT-10450)
IC2 = microbuilder:LTC4311
J1-J3 = SparkFun-Connectors:I2C_STANDARD: SparkFun I2C Standard Pinout Header SparkFun has standardized on a pinout for all I2C based sensor breakouts. This pinout allows I2C boards to be plugged directly into the headers on Arduino Uno compatible boards, and to be daisy chained easily. Example SparkFun Products: SparkFun Atmospheric Sensor Breakout - BME280 <https://www.sparkfun.com/products/13676> SparkFun Altitude/Pressure Sensor Breakout - MPL3115A2 <https://www.sparkfun.com/products/11084> SparkFun TOF Range Finder Sensor - VL6180 <https://www.sparkfun.com/products/12785>
J6 J7 = SparkFun-Connectors:QWIIC_CONNECTOR: SparkFun I2C Standard Qwiic Connector An SMD 1mm pitch JST connector makes it easy and quick (get it? Qwiic?) to connect I2C devices to each other. The Qwiic system <http://www.sparkfun.com/qwiic> enables fast and solderless connection between popular platforms and various sensors and actuators. We carry 200mm <https://www.sparkfun.com/products/14204>, 100mm <https://www.sparkfun.com/products/14205>, 50mm <https://www.sparkfun.com/products/14206>, and breadboard friendly <https://www.sparkfun.com/products/14207> Qwiic cables. We also offer 10 pcs strips <https://www.sparkfun.com/products/14323> the SMD connectors.; PROD_ID: CONN-14483
J8 = SparkFun-Connectors:POWER_JACK: Power Jack Connector This is the standard 5.5mm barrel jack for power. The PTH is the most common, proven, reliable, footprint. The Slot footprint only works if the mill layer is transmitted to the PCB fab house so be warned. Here are the connectors we sell at SparkFun: DC Barrel Power Jack/Connector <https://www.sparkfun.com/products/119> (PRT-00119) DC Barrel Power Jack/Connector (SMD) <https://www.sparkfun.com/products/12748> (PRT-12748) DC Barrel Jack Adapter - Breadboard Compatible <https://www.sparkfun.com/products/10811> (PRT-10811) It is used on this SparkFun product (and many, many others): SparkFun RedBoard - Programmed with Arduino <https://www.sparkfun.com/products/12757> (DEV-12757) Also, if you need a mating power supply or connector, please check these out: Wall Adapter Power Supply - 9VDC 650mA <https://www.sparkfun.com/products/298> (TOL-00298) DC Barrel Jack Adapter - Male <https://www.sparkfun.com/products/10287> (PRT-10287); PROD_ID: CONN-08197
JP1-JP3 = microbuilder:HEADER-1X3: PIN HEADER
JP5-JP10 JP12-JP19 = adafruit:PINHD-1X3: PIN HEADER
JP11 JP20-JP30 = pinhead:PINHD-1X3: PIN HEADER
JP31 = microbuilder:JUMPER3: JUMPER - 3 Pins
K5-K8 K13-K16 K21-K24 = relay:ZF112: RELAY 1 x switch; OC_FARNELL: unknown; OC_NEWARK: unknown
L1 L2 = rcl:L-US: INDUCTOR, American symbol; SPICEPREFIX: L
LED5-LED16 = microbuilder:LED: LED 0603 - 0603 Surface Mount Package 2mA: Green LED - Low Power (3.9mcd, 2ma, 1.7Vf) - Digikey: 475-2709-2-ND Orange LED - Low Power (9.8mcd, 2ma, 1.8Vf) - Digikey: 475-1194-2-ND Red LED - Low Power (5mcd, 2ma, 1.8Vf) - Digikey: 475-1195-2-ND Yellow LED - Low Power (7mcd, 2ma, 1.8Vf) - Digikey: 475-1196-2-ND 5mA: Blue LED - Low Power (17mcd, 5ma, 2.9Vf) - Digikey: LNJ937W8CRACT-ND 0805 - 0805 Surface Mount Package 2mA: Red LED (8.8mcd, 2mA, 1.8Vf, Clear) - Low Power [Digikey: 475-2510-1-ND] Green LED (5mcd, 2mA, 1.8Vf, Clear) - Low Power [Digikey: 475-2730-1-ND] Yellow LED (11.3mcd, 2mA, 1.8Vf, Clear) - Low Power [Digikey: 475-2555-1-ND] 20mA: Red LED (104mcd, 20mA, Diffused) - LS R976 [Digikey: 475-1278-6-ND] Red LED (12mcd, 20mA, 2.0Vf, Clear) - APT2012EC [Digikey: 754-1128-1-ND] Green LED (15mcd, 20mA, 2.2Vf, Clear) - APT2012GC [Digikey: 754-1131-1-ND] Orange LED (160mcd, 20mA, 2.1Vf, Clear) - APT2012SECK [Digikey: 754-1130-1-ND] 1206 - 1206 Surface Mount Package Green LED (26mcd, 20mA, Diffused) - LG N971 [Digikey: 475-1407-6-ND] Red LED (15mcd, 20mA, Diffused) - LH N974 [Digikey: 475-1416-6-ND] Cree - Cree High-Power Surface Mount LEDs XPEBWT-L1-0000-00D50 - White 111lm 350mA 2.9Vf 6200K 110° XTEAWT-00-0000-00000LEE3 - White 114lm 350mA 2.85Vf 5000K 115° Everlight - Everlight 45-21 Series Surface Mount LEDs 45-21/QK2C-B2832AC2CB2/2T - Warm White 2000mcd 20mA 3.25Vf 3050K 120° 45-21/LK2C-B38452C4CB2/2T - Nuetral White 2000mcd 20mA 3.25Vf 4150K 120° 45-21/LK2C-B50634C6CB2/2T - Cold White 2200mcd 20mA 3.25Vf 5650K 120° PLCC2 Reverse Mount LS T77K-J1L2-1-0-2-R18-Z - Red 11.25mcd 2mA 1.8Vf 630nm 120° LO T77K-L1M2-24-Z - Orange 19.6mcd 2mA 1.8Vf 606nm 120° LY T77K-K2M1-26-Z - Yellow 15.7mcd 2mA 1.8Vf 587nm 120°
OK5-OK8 OK13-OK16 OK21-OK24 = optocoupler:PC817: SHARP OPTO COUPLER; MPN: PC817X4J000F; OC_FARNELL: 9707727; OC_NEWARK: 97K7059
PS1-PS4 = RFM-0505S:RFM-0505S: DC/DC Converter, 1 Watt, SIP4, Single Output Check availability <https://pricing.snapeda.com/parts/RFM-0505S/Recom%20Power/view-part?ref=eda>; AVAILABILITY: In Stock; DESCRIPTION: 1W DC/DC-Converter 'ECONOLINE' SIP4 1kV unreg; MF: Recom Power; MP: RFM-0505S; PACKAGE: SIP-4 Recom Power; PRICE: None; PURCHASE-URL: https://pricing.snapeda.com/search/part/RFM-0505S/?ref=eda
Q2 Q4 = SparkFun:MOSFET-NCHANNEL
Q5-Q8 Q13-Q16 Q21-Q24 = transistor-npn:BC847*: NPN Transistor
R1-R7 R10 R11 = rcl:R-US_: RESISTOR, American symbol; SPICEPREFIX: R
R1A1 R1A2 R1B1 R1B2 R2A1 R2A2 R2B1 R2B2 R4A1 R4A2 R4B1 R4B2 R5A1 R5A2 R5B1 R5B2 = adafruit:R-US_: RESISTOR, American symbol
R9 R12-R14 R16-R18 R20 R21 = microbuilder:RESISTOR_4PACK: Resistor Packs (4 resistors) 4 x 0603 10K 1/16W - Digikey: YC164J-10KCT-ND
R15 R19 R22 R23 = SparkFun:RESISTOR: Resistor Basic schematic elements and footprints for 0603, 1206, and PTH resistors.
R25-R32 R41-R48 R57-R64 = rcl:R-EU_: RESISTOR, European symbol
U1 = MCP23017-E_SO:MCP23017-E/SO: MCP23017 Series 5.5 V 1.7 MHz SMT 16-Bit I2C I/O Expander - SOIC-28 Check availability <https://pricing.snapeda.com/parts/MCP23017-E/SO/Microchip/view-part?ref=eda>; AVAILABILITY: In Stock; DESCRIPTION: I/O Expander 16 I²C 1.7 MHz 28-SOIC; MF: Microchip; MP: MCP23017-E/SO; PACKAGE: SOIC-28 Microchip; PRICE: None; PURCHASE-URL: https://pricing.snapeda.com/search/part/MCP23017-E/SO/?ref=eda
U2 U3 = SparkFun-IC-Amplifiers:LM358: LM358 Jellybean op-amp Datasheet <http://www.sparkfun.com/datasheets/Components/General/LM358.pdf> SparkFun Products Op-Amp (Thru-Hole) - LM358 <https://www.sparkfun.com/products/9456> (COM-09456)
U4 = MC34063ADR:MC34063ADR; MANUFACTURER_PART_NUMBER: MC34063ADR; VENDOR: Texas Instruments
X1-X3 X6 X7 X11 X14 X17 X22 = Rembrandt Electronics - JST XH Connectors v1-0:JST-XH-02-PIN: JST XH Connector 2 Pin Wire to board connector. Pitch: 2,54 mm, (0.100") Number of pins: 2 Created by Rembrandt Electronics www.rembrandtelectronics.com
X8 X10 X12 X15 = adafruit_power:ISO154X
X9 X13 X16 = con-tycoelectronics:RJ45: CORCOM Modular RJ Jacks No Shield Source: www.tycoelectronics.com .. ENG_DS_1654001_1099_RJ_L_0507.pdf; MPN: RJ45-6L-B; OC_FARNELL: unknown; OC_NEWARK: 16R6090
X18-X21 = con-coax:BU-SMA-G: FEMALE SMA CONNECTOR Radiall distributor RS 193-9117; OC_FARNELL: unknown; OC_NEWARK: unknown

## Net classes
1 highpower: width 0.406 mm, drill 0.483 mm
2 12v: width 0.457 mm, drill 0.102 mm, clearance 0.254 mm
3 5v: width 0.406 mm, drill 0.102 mm, clearance 0.254 mm
4 3.3v: width 0.406 mm, drill 0.102 mm, clearance 0.254 mm
5 i2c: width 0.356 mm, drill 0.102 mm, clearance 0.254 mm
6 GPIO: width 0.356 mm, drill 0.102 mm, clearance 0.254 mm
8 New Class: drill 0.102 mm, clearance 0.152 mm